# EAGLE design untitled (EAGLE 6.3)
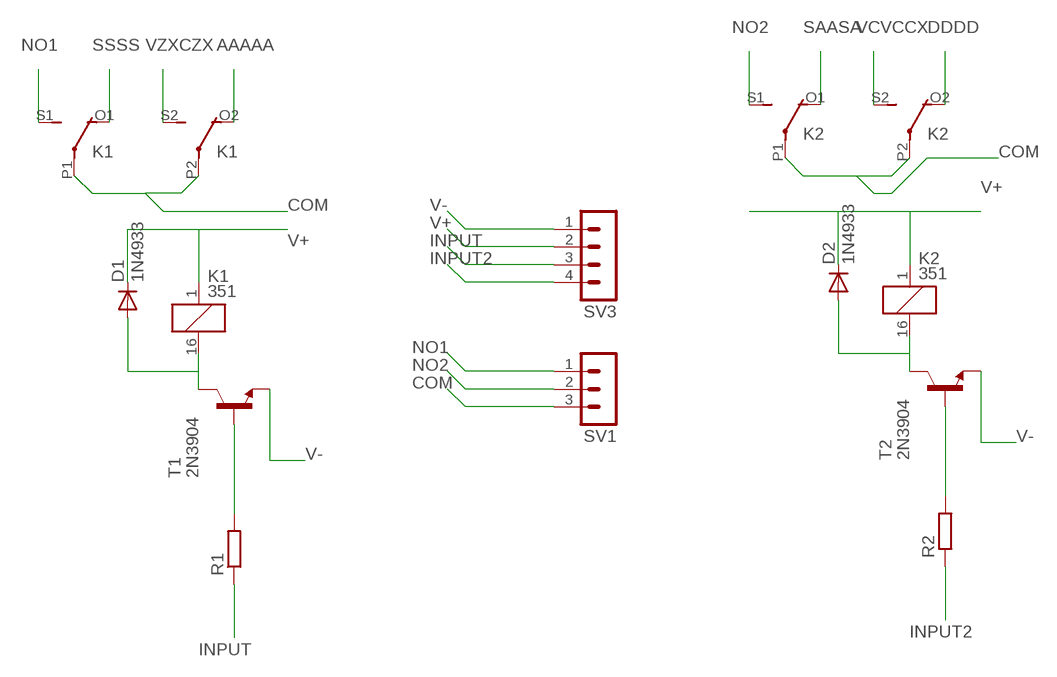
[diagram p0: schematic, sheet 1]

## Parts
D1  1N4933  [DO41-10]
D2  1N4933  [DO41-10]
K1  351  [351]
K2  351  [351]
R1  R-EU_0309/12  [0309/12]
R2  R-EU_0309/12  [0309/12]
SV1  MA03-1  [MA03-1]
SV3  MA04-1  [MA04-1]
T1  2N3904  [TO92]
T2  2N3904  [TO92]

## Nets
AAAAA: K1.O2(3:O)
COM: K1.P1(2:P) K1.P2(3:P) K2.P1(2:P) K2.P2(3:P) SV1.3
DDDD: K2.O2(3:O)
INPUT: R1.1 SV3.3
INPUT2: R2.1 SV3.4
N$1: R1.2 T1.2(B)
N$2: R2.2 T2.2(B)
N$3: D2.A K2.16 T2.1(C)
N$4: D1.A K1.16 T1.1(C)
NO1: K1.S1(2:S) SV1.1
NO2: K2.S1(2:S) SV1.2
SAASA: K2.O1(2:O)
SSSS: K1.O1(2:O)
V+: D1.C D2.C K1.1 K2.1 SV3.2
V-: SV3.1 T1.3(E) T2.3(E)
VCVCCX: K2.S2(3:S)
VZXCZX: K1.S2(3:S)

## Library data of the parts
D1 D2 = diode:1N4933: DIODE fast recovery rectifier, 1A
K1 K2 = relay:351: RELAY 2 x switch, Omron; OC_FARNELL: unknown; OC_NEWARK: unknown
R1 R2 = resistor:R-EU_: RESISTOR, European symbol
SV1 = con-lstb:MA03-1: PIN HEADER; OC_FARNELL: unknown; OC_NEWARK: unknown
SV3 = con-lstb:MA04-1: PIN HEADER; OC_FARNELL: unknown; OC_NEWARK: unknown
T1 T2 = transistor:2N3904: NPN TRANSISTOR

## Board
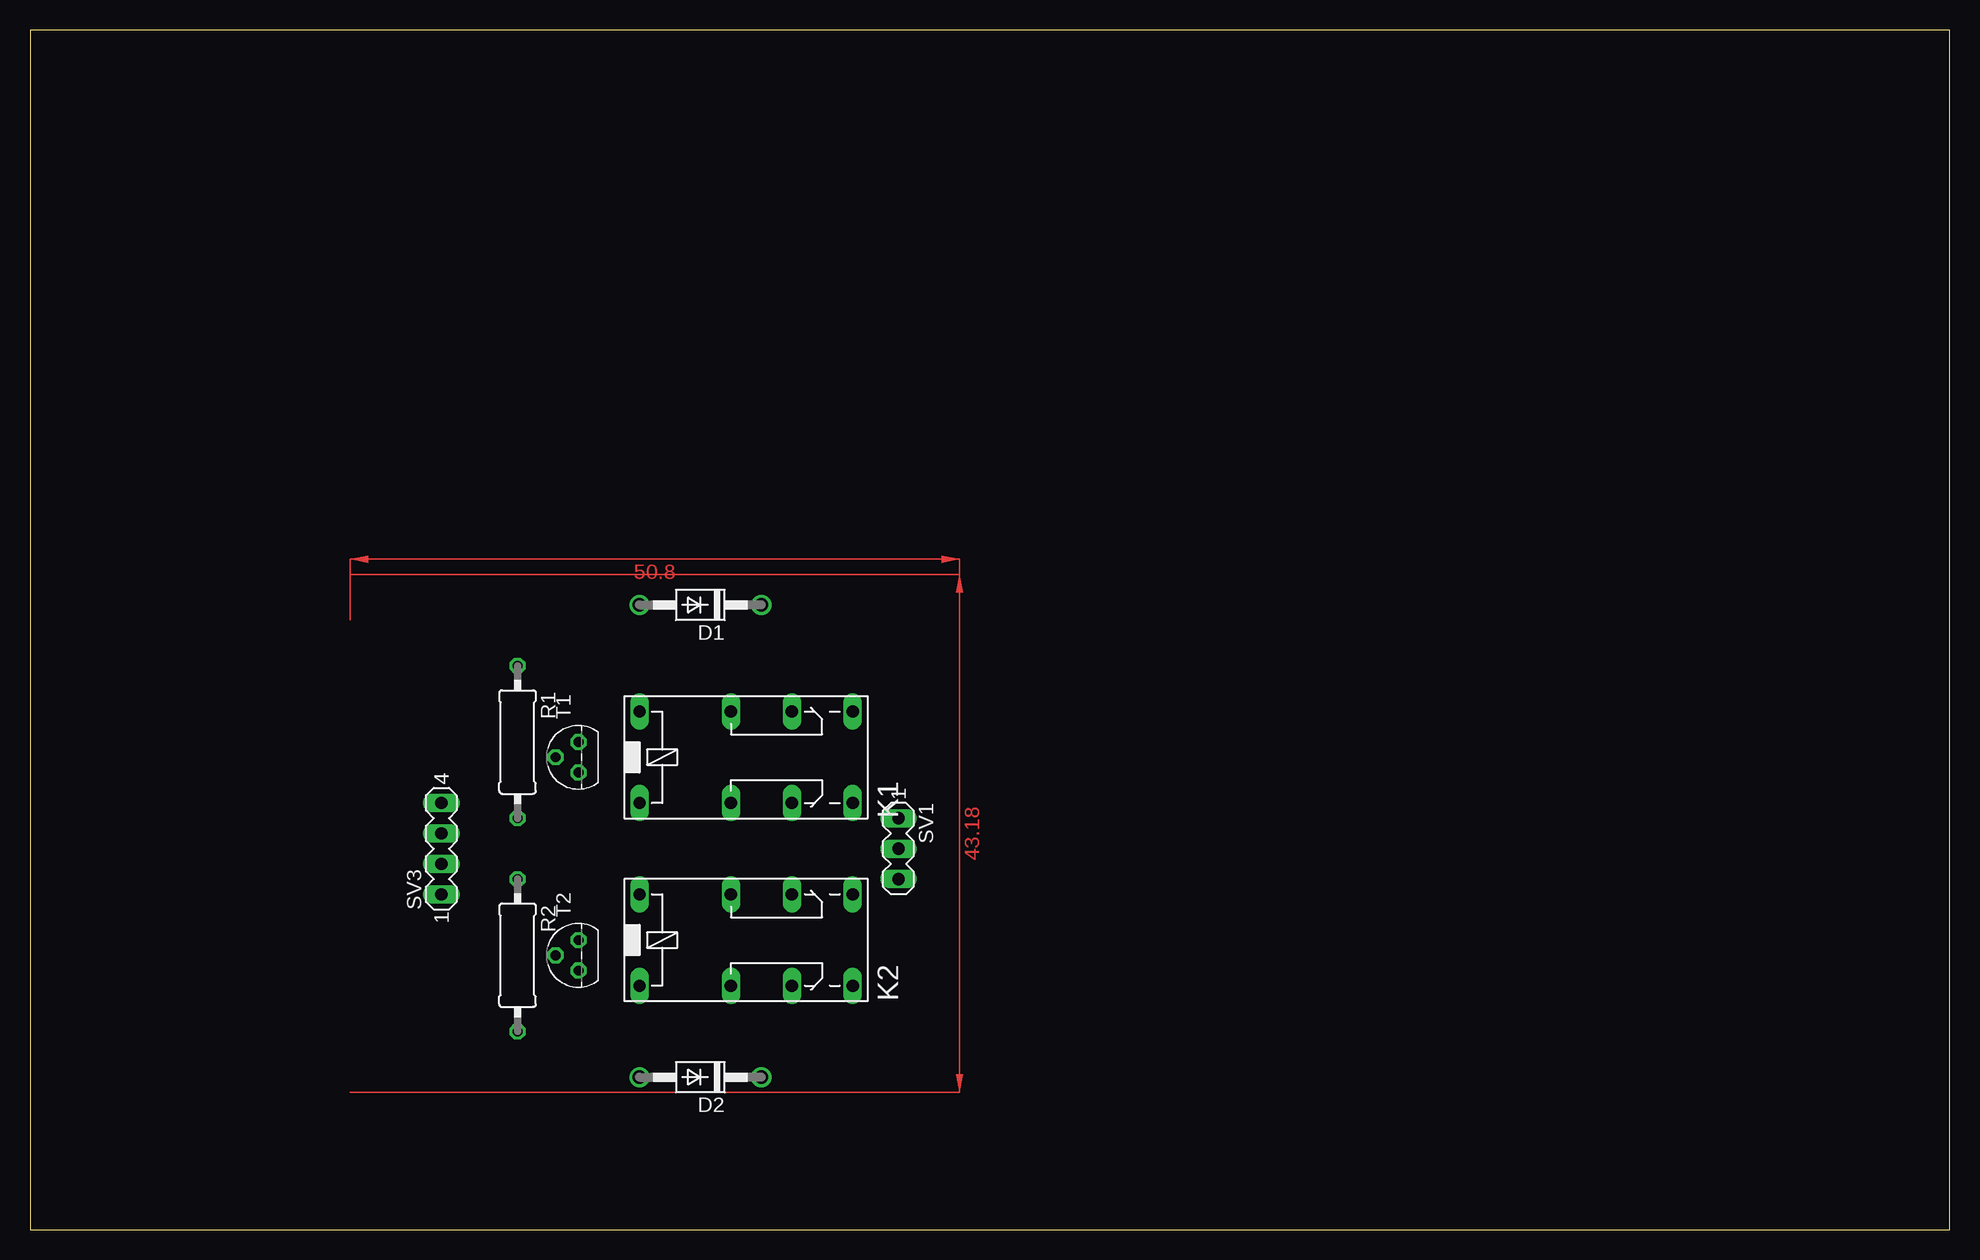
[diagram p1: board, top side]
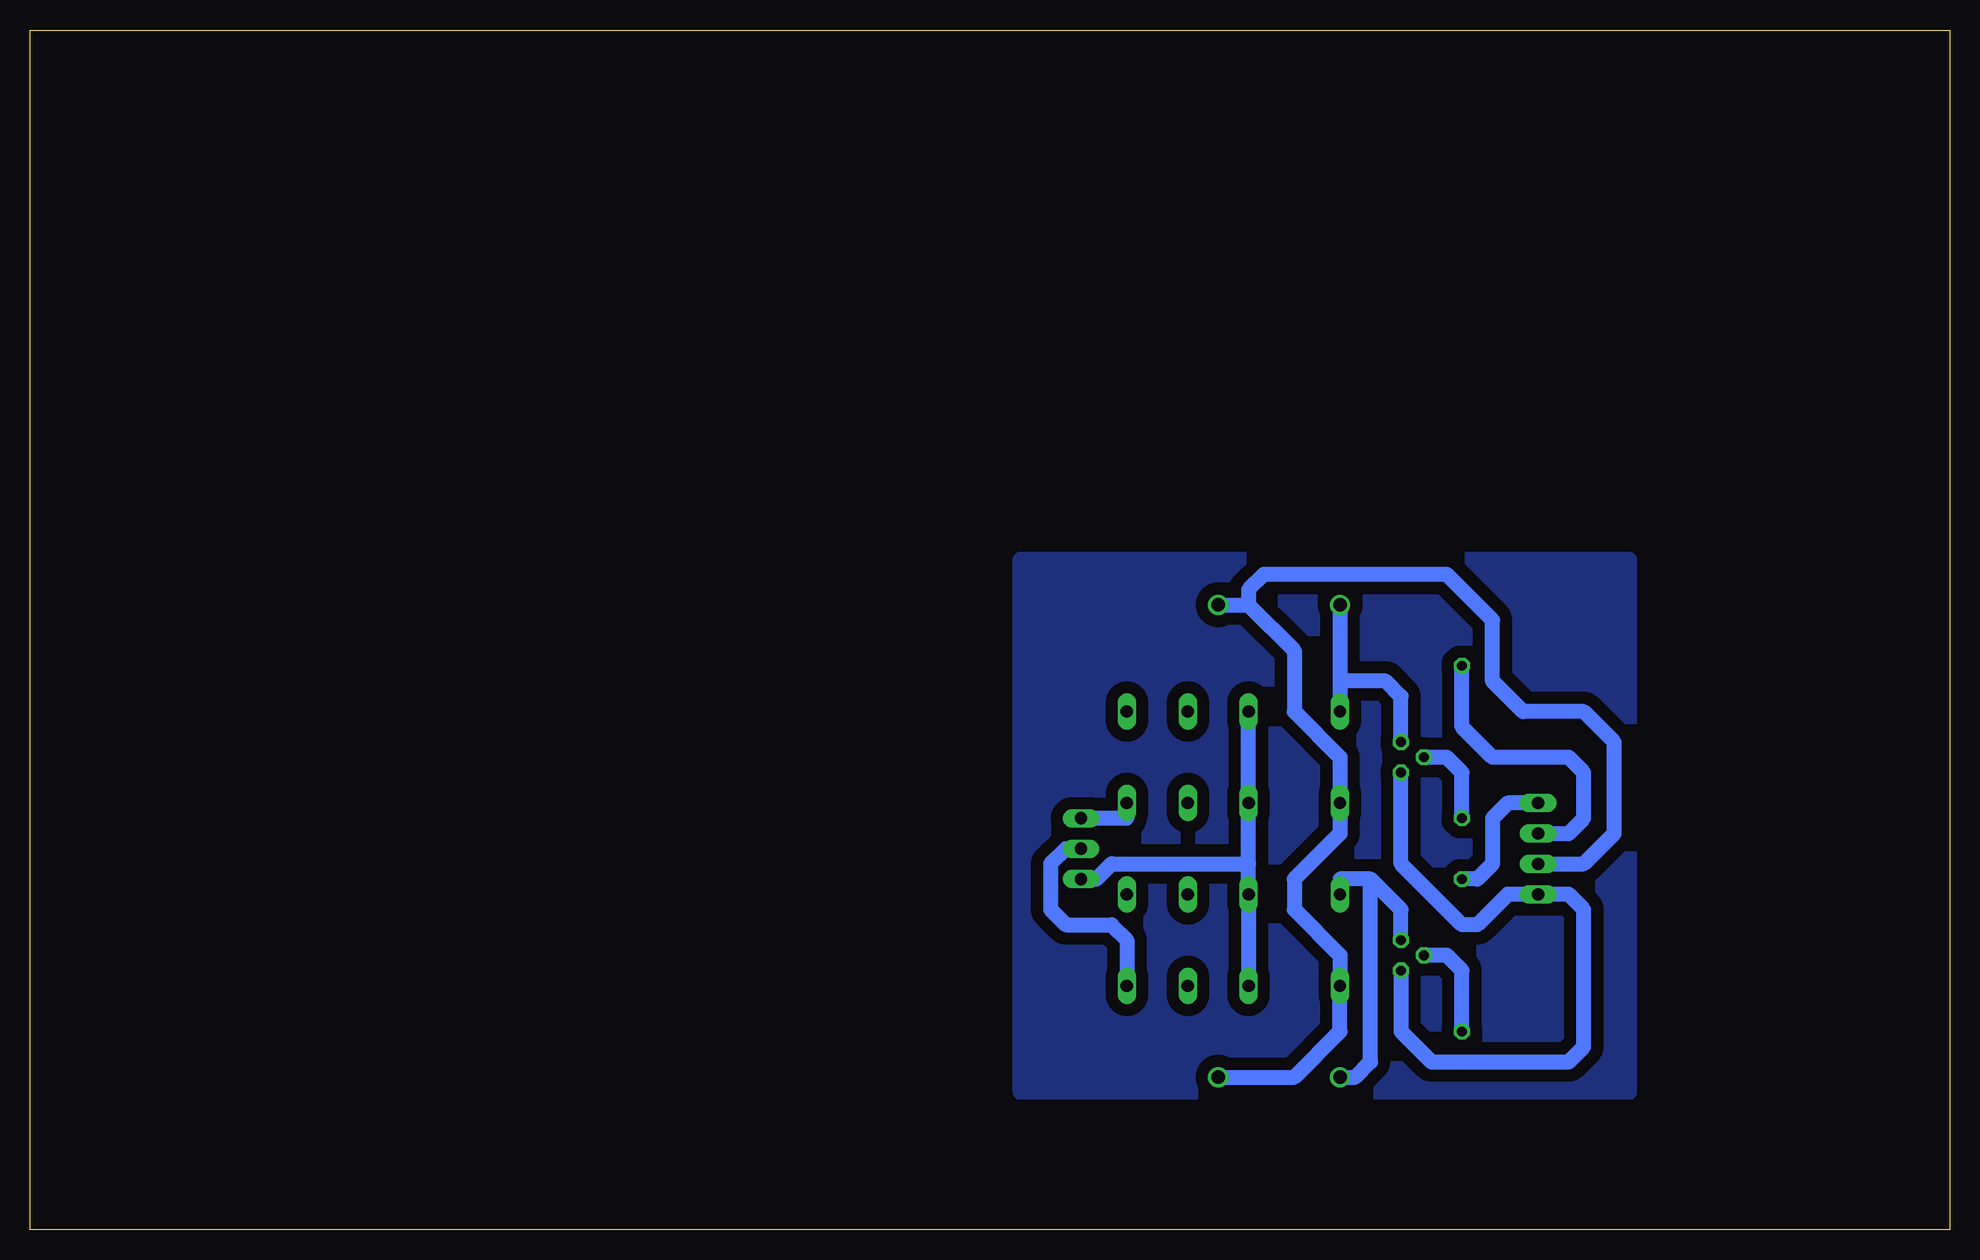
[diagram p2: board, bottom side, seen from below]

Size 160 x 100 mm. Coordinates in mm from the lower left corner, seen from the top.
Outline: 0,0 160,0 160,100 0,100 0,0
Copper layers (1*16): Top 0.035mm / dielectric 1.5mm / Bottom 0.035mm
Design rules "default *": minimum track width 10mil, minimum drill 24mil, track to track 40mil, track to pad 40mil, pad to pad 8mil, via to via 8mil, smd to smd 8mil, copper to edge 40mil, drill to drill 8mil, minimum pad ring 10mil, minimum via ring 8mil, stop-mask expansion 4mil, vias tented up to drill 0mil, thermal gap 10mil

### Footprints (pad centres in the part's own frame; a part is rotated, then mirrored left to right if it is on the bottom)
DO41-10 = drill 1.118: A 5.08,0; C -5.08,0
351 = drill 1.016 long: 1 -3.81,-3.81; 16 -3.81,3.81; O1 8.89,-3.81; O2 8.89,3.81; P1 3.81,-3.81; P2 3.81,3.81; S1 13.97,-3.81; S2 13.97,3.81
0309/12 = drill 0.813 octagon: 1 -6.35,0; 2 6.35,0
MA03-1 = drill 1.016 long: 1 -2.54,0; 2 0,0; 3 2.54,0
MA04-1 = drill 1.016 long: 1 -3.81,0; 2 -1.27,0; 3 1.27,0; 4 3.81,0
TO92 = drill 0.813 octagon: 1 1.27,0; 2 0,1.905; 3 -1.27,0

### Placement (x,y rotation side)
D1  55.88,52.07 180 top
D2  55.88,12.7 180 top
K1  54.61,39.37 0 top
K2  54.61,24.13 0 top
R1  40.64,40.64 270 top
R2  40.64,22.86 270 top
SV1  72.39,31.75 270 top
SV3  34.29,31.75 90 top
T1  45.72,39.37 90 top
T2  45.72,22.86 90 top

### Tracks (layer width: path | path; a pad name or v marks a point on that pad's centre or on a via)
COM
  Bottom 1.27: K2.P1 K2.P2 58.42,30.48 | 58.42,30.48 K1.P1 K1.P2 | SV1.3 71.12,29.21 69.85,30.48 58.42,30.48
INPUT
  Bottom 1.27: SV3.3 31.75,33.02 30.48,34.29 30.48,38.1 31.75,39.37 38.1,39.37 40.64,41.91 R1.1
INPUT2
  Bottom 1.27: SV3.4 36.83,35.56 38.1,34.29 38.1,30.48 39.37,29.21 R2.1
N$1
  Bottom 1.27: R1.2 40.64,38.1 41.91,39.37 T1.2
N$2
  Bottom 1.27: R2.2 40.64,21.59 41.91,22.86 T2.2
N$3
  Bottom 1.27: T2.1 45.72,26.67 48.26,29.21 | 48.26,29.21 50.8,29.21 K2.16 | D2.A 49.53,12.7 48.26,13.97 48.26,29.21
N$4
  Bottom 1.27: D1.A 50.8,45.72 | 50.8,45.72 K1.16 | T1.1 45.72,44.45 46.99,45.72 50.8,45.72
N$5
  pour Bottom: 26.67,55.88 26.67,11.43 77.47,11.43 77.47,55.88
NO1
  Bottom 1.27: K1.S1 68.58,34.29 SV1.1
NO2
  Bottom 1.27: SV1.2 73.66,31.75 74.93,30.48 74.93,26.67 73.66,25.4 69.85,25.4 68.58,24.13 K2.S1
V+
  Bottom 1.27: D1.C 58.42,52.07 | 58.42,52.07 54.61,48.26 54.61,43.18 50.8,39.37 K1.1 50.8,33.02 54.61,29.21 54.61,26.67 50.8,22.86 K2.1 50.8,16.51 54.61,12.7 D2.C | SV3.2 30.48,30.48 27.94,33.02 27.94,40.64 30.48,43.18 35.56,43.18 38.1,45.72 38.1,50.8 41.91,54.61 57.15,54.61 58.42,53.34 58.42,52.07
V-
  Bottom 1.27: T2.3 45.72,16.51 43.18,13.97 31.75,13.97 30.48,15.24 30.48,26.67 31.75,27.94 SV3.1 36.83,27.94 39.37,25.4 40.64,25.4 45.72,30.48 T1.3
(copper drawn outside any net)
  shapes: Bottom area x2, Top area x2